# Altium schematic sheet Count_3x7Seg_Display.SchDoc
size 431 x 279 mm; SheetNumber: 1; SheetTotal: 1; ENG_APP_DATE: --/--/--; DSN_APP_DATE: --/--/--; CHK_APP_DATE: --/--/--
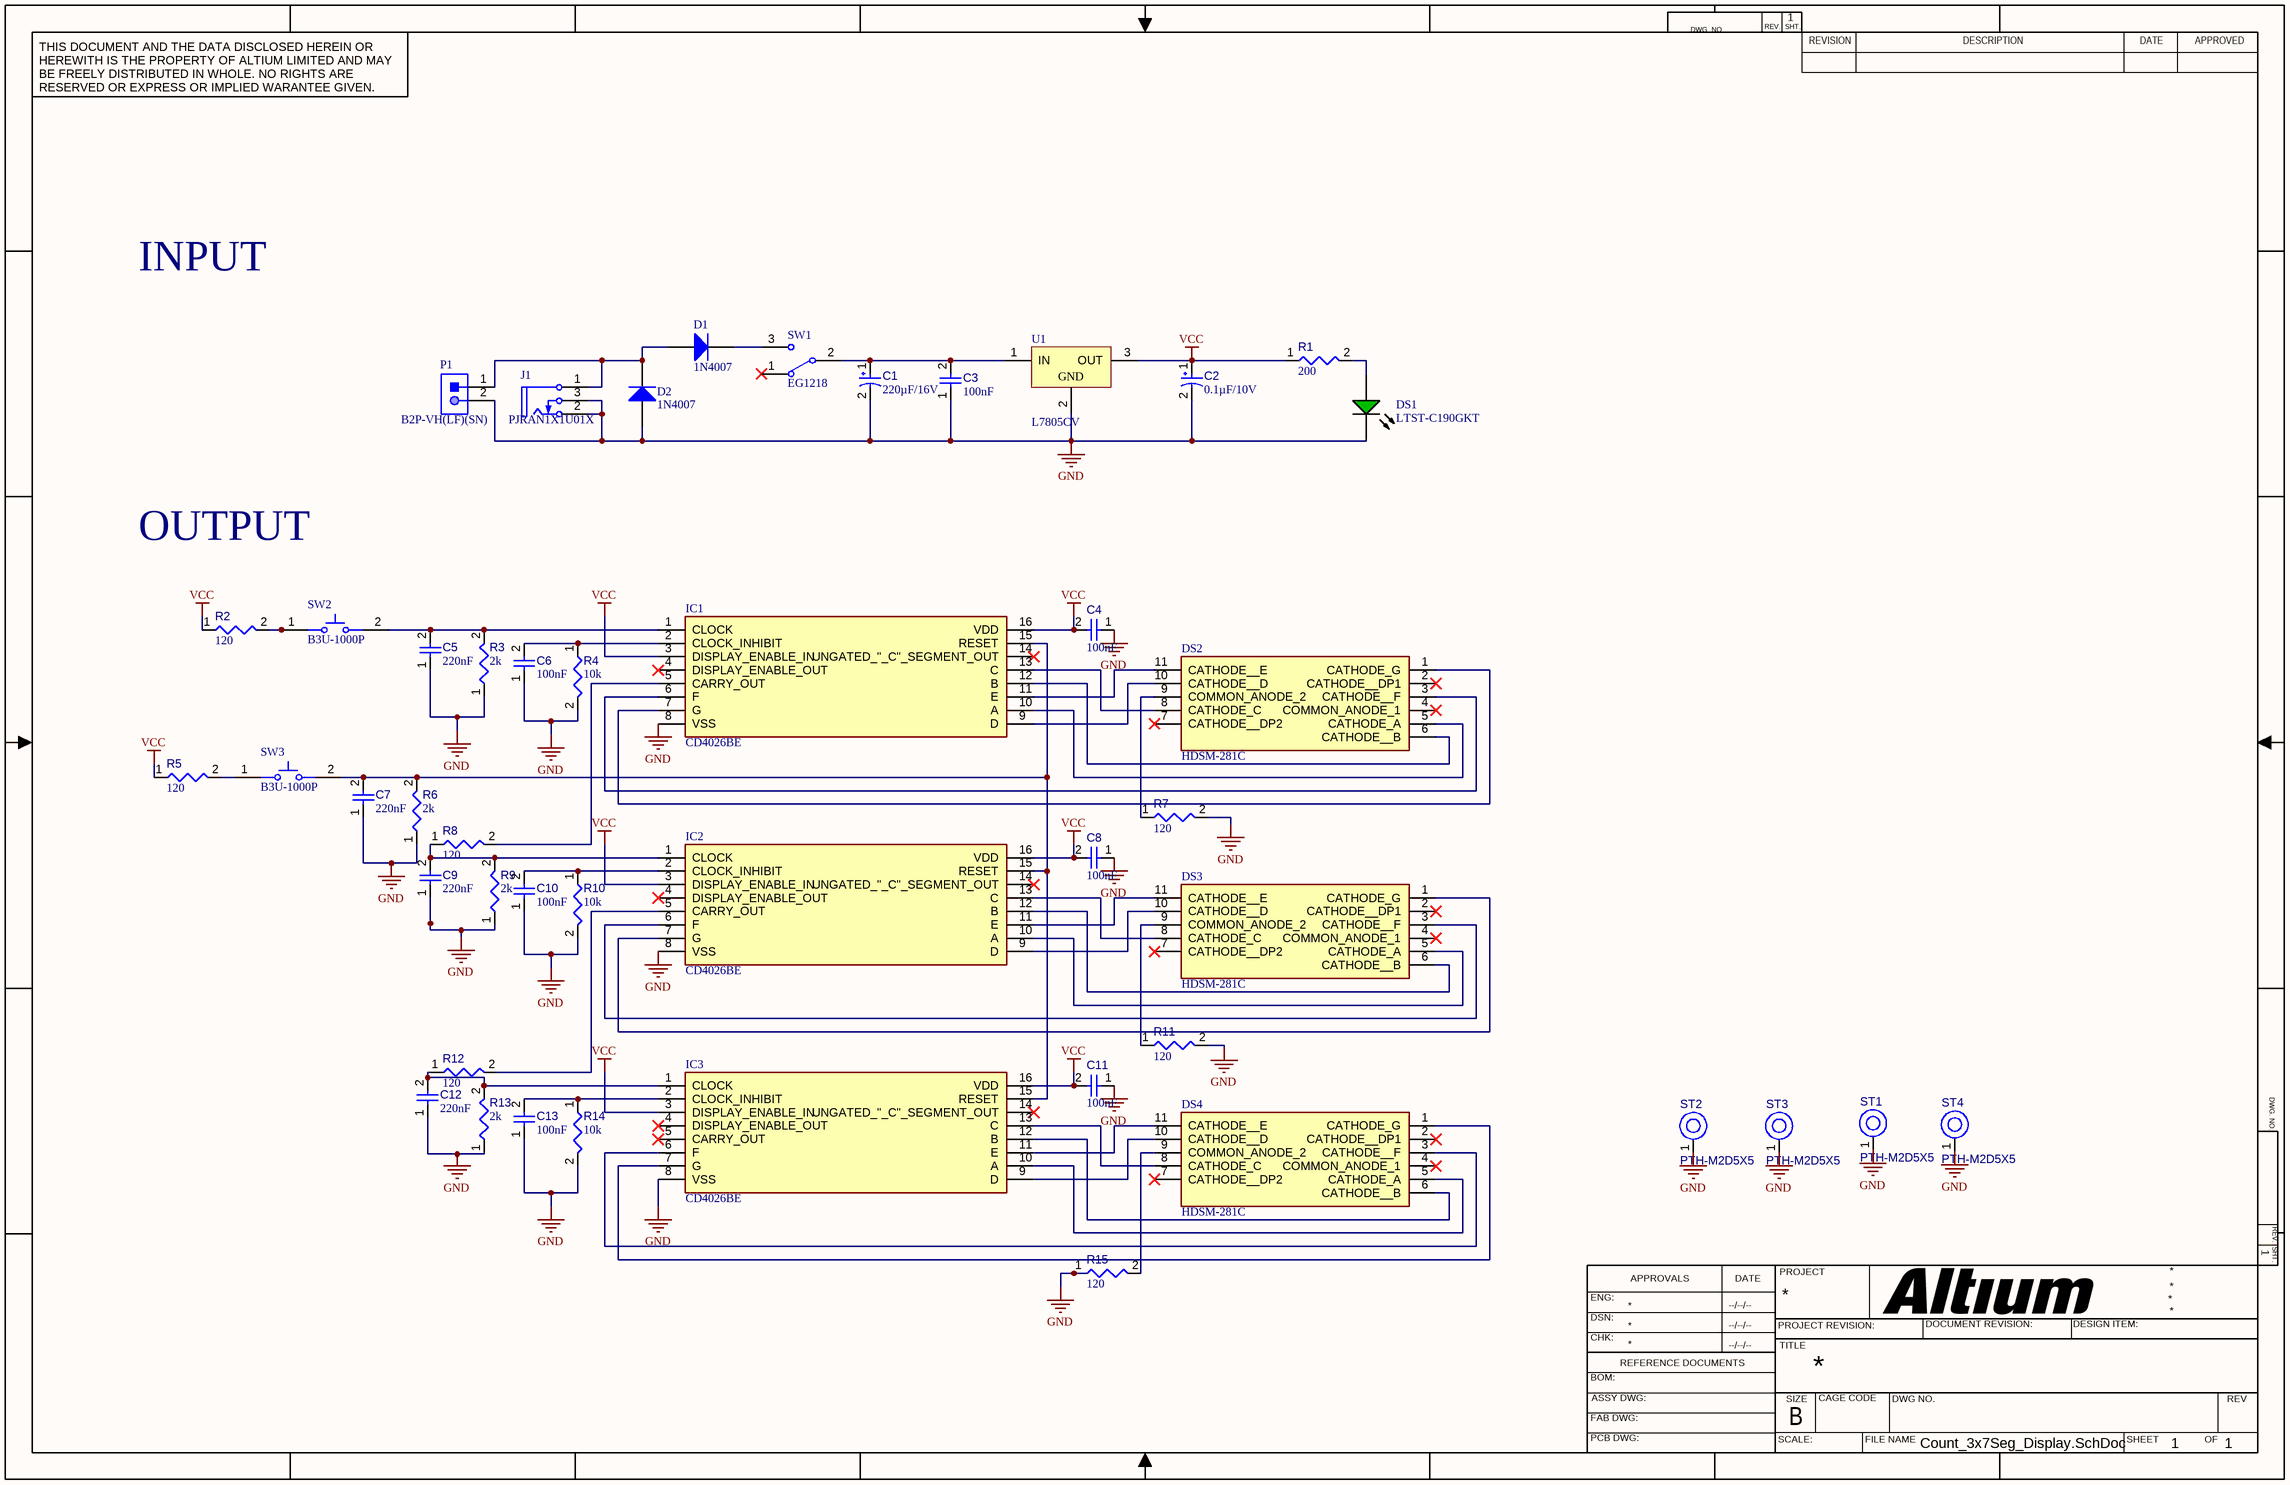
[diagram p0: Count_3x7Seg_Display.SchDoc]

## Parts
C1  value 220µF/16V  [CAPPR55-250-1120X630X1220]  (hidden comment: ECA-1HM470)
C2  value 0.1µF/10V  [CAPPR55-250-1120X630X1220]  (hidden comment: ECA-1HM470)
C3  value 100nF  [CAPC1608X90X40NL10T20]  (hidden comment: Capacitor 100 nF +/-10% 50 V 0603)
C4  value 100nF  [CAPC1608X90X40NL10T20]  (hidden comment: Capacitor 100 nF +/-10% 50 V 0603)
C5  value 220nF  [CAPC0402(1005)60_L]  (hidden comment: Capacitor 220nF +/-20% 10V 0402)
C6  value 100nF  [CAPC1608X90X40NL10T20]  (hidden comment: Capacitor 100 nF +/-10% 50 V 0603)
C7  value 220nF  [CAPC0402(1005)60_L]  (hidden comment: Capacitor 220nF +/-20% 10V 0402)
C8  value 100nF  [CAPC1608X90X40NL10T20]  (hidden comment: Capacitor 100 nF +/-10% 50 V 0603)
C9  value 220nF  [CAPC0402(1005)60_L]  (hidden comment: Capacitor 220nF +/-20% 10V 0402)
C10  value 100nF  [CAPC1608X90X40NL10T20]  (hidden comment: Capacitor 100 nF +/-10% 50 V 0603)
C11  value 100nF  [CAPC1608X90X40NL10T20]  (hidden comment: Capacitor 100 nF +/-10% 50 V 0603)
C12  value 220nF  [CAPC0402(1005)60_L]  (hidden comment: Capacitor 220nF +/-20% 10V 0402)
C13  value 100nF  [CAPC1608X90X40NL10T20]  (hidden comment: Capacitor 100 nF +/-10% 50 V 0603)
D1  1N4007  [FAIR-DO-41-2]
D2  1N4007  [FAIR-DO-41-2]
DS1  LTST-C190GKT  [LTST-C190GKT_V]
DS2  HDSM-281C  [HDSM283L]
DS3  HDSM-281C  [HDSM283L]
DS4  HDSM-281C  [HDSM283L]
IC1  CD4026BE  [DIP794W53P254L1930H508Q16N]
IC2  CD4026BE  [DIP794W53P254L1930H508Q16N]
IC3  CD4026BE  [DIP794W53P254L1930H508Q16N]
J1  PJRAN1X1U01X  [SWIT-PJRAN1X1U01X_V]
P1  B2P-VH(LF)(SN)  [JST-B2P-VH(LF)(SN)_V]
R1  value 200  [RESC0402(1005)_L]  (hidden comment: 200R2J)
R2  value 120  [RESC0603(1608)_L]  (hidden comment: 120R3J)
R3  value 2k  [RESC0402(1005)_L]  (hidden comment: Resistor 2K +/-5 % 0402 63 mW)
R4  value 10k  [RESC1005X40X25ML05T05]  (hidden comment: Resistor 10k +/-1% 0402 100 mW)
R5  value 120  [RESC0603(1608)_L]  (hidden comment: 120R3J)
R6  value 2k  [RESC0402(1005)_L]  (hidden comment: Resistor 2K +/-5 % 0402 63 mW)
R7  value 120  [RESC0603(1608)_L]  (hidden comment: 120R3J)
R8  value 120  [RESC0603(1608)_L]  (hidden comment: 120R3J)
R9  value 2k  [RESC0402(1005)_L]  (hidden comment: Resistor 2K +/-5 % 0402 63 mW)
R10  value 10k  [RESC1005X40X25ML05T05]  (hidden comment: Resistor 10k +/-1% 0402 100 mW)
R11  value 120  [RESC0603(1608)_L]  (hidden comment: 120R3J)
R12  value 120  [RESC0603(1608)_L]  (hidden comment: 120R3J)
R13  value 2k  [RESC0402(1005)_L]  (hidden comment: Resistor 2K +/-5 % 0402 63 mW)
R14  value 10k  [RESC1005X40X25ML05T05]  (hidden comment: Resistor 10k +/-1% 0402 100 mW)
R15  value 120  [RESC0603(1608)_L]  (hidden comment: 120R3J)
ST1  PTH-M2D5X5  [PTH-M2D5X5]
ST2  PTH-M2D5X5  [PTH-M2D5X5]
ST3  PTH-M2D5X5  [PTH-M2D5X5]
ST4  PTH-M2D5X5  [PTH-M2D5X5]
SW1  EG1218  [ESWI-EG1218_V]
SW2  B3U-1000P  [OMRON-B3U-1000_V]
SW3  B3U-1000P  [OMRON-B3U-1000_V]
U1  L7805CV  [TO220]

## Nets
GND: C1.2 C2.2 C3.1 C4.1 C5.1 C6.1 C7.1 C8.1 C9.1 C10.1 C11.1 C12.1 C13.1 D2.2(A) DS1.2(K) IC1.8(VSS) IC2.8(VSS) IC3.8(VSS) J1.2(TIP) J1.3(SHUNT) P1.2 R3.1 R4.2 R6.1 R7.2 R9.1 R10.2 R11.2 R13.1 R14.2 R15.1 ST1.1(H1) ST2.1(H1) ST3.1(H1) ST4.1(H1) U1.2(GND)
VCC: C2.1 C4.2 C8.2 C11.2 IC1.3(DISPLAY_ENABLE_IN) IC1.16(VDD) IC2.3(DISPLAY_ENABLE_IN) IC2.16(VDD) IC3.3(DISPLAY_ENABLE_IN) IC3.16(VDD) R1.1 R2.1 R5.1 U1.3(OUT)
NetC1_1: C1.1 C3.2 SW1.2(COM) U1.1(IN)
NetC5_2: C5.2 IC1.1(CLOCK) R3.2 SW2.2
NetC6_2: C6.2 IC1.2(CLOCK_INHIBIT) R4.1
NetC7_2: C7.2 IC1.15(RESET) IC2.15(RESET) IC3.15(RESET) R6.2 SW3.2
NetC9_2: C9.2 IC2.1(CLOCK) R8.1 R9.2
NetC10_2: C10.2 IC2.2(CLOCK_INHIBIT) R10.1
NetC12_2: C12.2 IC3.1(CLOCK) R12.1 R13.2
NetC13_2: C13.2 IC3.2(CLOCK_INHIBIT) R14.1
NetD1_1: D1.1(K) SW1.3
NetD1_2: D1.2(A) D2.1(K) J1.1(SLEEVE) P1.1
NetDS1_1: DS1.1(A) R1.2
NetDS2_1: DS2.1(CATHODE_G) IC1.7(G)
NetDS2_3: DS2.3(CATHODE__F) IC1.6(F)
NetDS2_5: DS2.5(CATHODE_A) IC1.10(A)
NetDS2_6: DS2.6(CATHODE__B) IC1.12(B)
NetDS2_8: DS2.8(CATHODE_C) IC1.13(C)
NetDS2_9: DS2.9(COMMON_ANODE_2) R7.1
NetDS2_10: DS2.10(CATHODE__D) IC1.9(D)
NetDS2_11: DS2.11(CATHODE__E) IC1.11(E)
NetDS3_1: DS3.1(CATHODE_G) IC2.7(G)
NetDS3_3: DS3.3(CATHODE__F) IC2.6(F)
NetDS3_5: DS3.5(CATHODE_A) IC2.10(A)
NetDS3_6: DS3.6(CATHODE__B) IC2.12(B)
NetDS3_8: DS3.8(CATHODE_C) IC2.13(C)
NetDS3_9: DS3.9(COMMON_ANODE_2) R11.1
NetDS3_10: DS3.10(CATHODE__D) IC2.9(D)
NetDS3_11: DS3.11(CATHODE__E) IC2.11(E)
NetDS4_1: DS4.1(CATHODE_G) IC3.7(G)
NetDS4_3: DS4.3(CATHODE__F) IC3.6(F)
NetDS4_5: DS4.5(CATHODE_A) IC3.10(A)
NetDS4_6: DS4.6(CATHODE__B) IC3.12(B)
NetDS4_8: DS4.8(CATHODE_C) IC3.13(C)
NetDS4_9: DS4.9(COMMON_ANODE_2) R15.2
NetDS4_10: DS4.10(CATHODE__D) IC3.9(D)
NetDS4_11: DS4.11(CATHODE__E) IC3.11(E)
NetIC1_5: IC1.5(CARRY_OUT) R8.2
NetIC2_5: IC2.5(CARRY_OUT) R12.2
NetR2_2: R2.2 SW2.1
NetR5_2: R5.2 SW3.1

Not connected (* = marked no-connect by the designer): DS2 2(CATHODE__DP1)* 4(COMMON_ANODE_1)* 7(CATHODE__DP2)*; DS3 2(CATHODE__DP1)* 4(COMMON_ANODE_1)* 7(CATHODE__DP2)*; DS4 2(CATHODE__DP1)* 4(COMMON_ANODE_1)* 7(CATHODE__DP2)*; IC1 4(DISPLAY_ENABLE_OUT)* 14(UNGATED_"_C"_SEGMENT_OUT)*; IC2 4(DISPLAY_ENABLE_OUT)* 14(UNGATED_"_C"_SEGMENT_OUT)*; IC3 4(DISPLAY_ENABLE_OUT)* 5(CARRY_OUT)* 14(UNGATED_"_C"_SEGMENT_OUT)*; SW1 1*

## Notes on the sheet
- INPUT
- OUTPUT
- DWG. NO.
- REV.
- SHT.
- THIS DOCUMENT AND THE DATA DISCLOSED HEREIN OR HEREWITH IS THE PROPERTY OF ALTIUM LIMITED AND MAY BE FREELY DISTRIBUTED IN WHOLE. NO RIGHTS ARE RESERVED OR EXPRESS OR IMPLIED WARANTEE GIVEN.
- REVISION
- DESCRIPTION
- DATE
- APPROVED
- ENG:
- APPROVALS
- PROJECT
- DSN:
- CHK:
- REFERENCE DOCUMENTS
- PROJECT REVISION:
- TITLE
- DOCUMENT REVISION:
- DESIGN ITEM:
- BOM:
- FAB DWG:
- PCB DWG:
- ASSY DWG:
- SCALE:
- SIZE
- B
- CAGE CODE
- FILE NAME
- DWG NO.
- SHEET
- OF
- REV

## Library data of the parts
C1 C2 = CMP-001-00031-7: Aluminum Electrolytic Capacitor, 47 uF, +/-20%, 50 V, -40 to 85 degC, 2-Pin THD, RoHS, Bulk; Manufacturer: Panasonic; Ripple Current: 130mA; Voltage Rating: 50V; Tolerance: 20%; RoHS Compliant: True; Lead Pitch: 2.5mm; Packaging: Bulk; Case/Package: Radial; Diameter: 6.3mm; Datasheet Version: Apr-16; Mounting Technology: TH; Max Operating Temperature: 85°C; Package Quantity: 200; Package Description: 2-Pin Radial Lead, Dia 6.3 mm, Height 12.2 mm; Capacitor Type: Electrolytic; Min Operating Temperature: -40°C; Ripple Current (AC): 130mA; Manufacturer URL: http://www.panasonic.com/; Pins: 2; Datasheet URL: https://industrial.panasonic.com/cdbs/www-data/pdf/RDF0000/DMF0000COL72.pdf; Package Reference: CAPPR55-250-1120X630X1220
C3 C4 C6 C8 C10 C11 C13 = CMP-001-00017-6: Chip Capacitor, 100 nF, +/- 10%, 50 V, 0603 (1608 Metric); Voltage Rating: 50V; Capacitor Type: Ceramic; Tolerance: 10%; Mounting Technology: SM; Max Operating Temperature: 125°C; RoHS Compliant: True; Pins: 2; Case/Package: 0603; Min Operating Temperature: -55°C
C5 C7 C9 C12 = CMP-001-00057-3: Chip Capacitor, 220nF +/-20%, 10V, 0402, Thickness 0.6 mm; Tolerance: 10%; Max Operating Temperature: 85°C; Pins: 2; Case/Package: 0402; Mounting Technology: SMT; Voltage Rating: 10V; Min Operating Temperature: -55°C
D1 D2 = CMP-004-00007-2: General Purpose Rectifier, 1.1 V, 1.0 A, -55 to 175 degC, 2-Pin DO-41, RoHS, Tape and Reel; Manufacturer: Fairchild; Peak Reverse Current: 5uA; Max Surge Current: 30A; Elements: 1; Forward Voltage: 1.1V; Package Version: Rev. 2, 09/2008; Forward Current: 1A; Package Quantity: 5000; Packaging: TapeandReel; Package URL: http://www.fairchildsemi.com/dwg/DO/DO41A.pdf; Manufacturer URL: https://www.fairchildsemi.com/; Package Reference: DO-41-2; Pins: 2; Min Operating Temperature: -55°C; Datasheet Version: Rev. 1.1.0, 11/2014; Max Operating Temperature: 175°C; RoHS Compliant: True; Case/Package: DO-41-2; Mounting Technology: TH; Package Description: 2-Pin Axial Lead, Dia 2.375 mm, Body Length 4.63 mm; Datasheet URL: https://www.fairchildsemi.com/datasheets/1N/1N4007.pdf
DS1 = CMP-007-00022-2: LED Uni-Color Green, 100 mW, 30 mA, -55 to 85 degC, 2-Pin SMD, RoHS, Tape and Reel; Manufacturer: Lite-On; Power: 100mW; Forward Voltage: 2.1V; Viewing Angle: 130degrees; Forward Current: 20mA; Luminous Intensity: 6mcd; Lens Style: Clear; Manufacturer URL: http://www.us.liteon.com/; RoHS Compliant: True; Colour: Green; Package Description: 2-Pin Surface Mount Device, Body 1.6 x 0.8 mm; Datasheet URL: http://datasheet.octopart.com/LTST-C190GKT-Lite-On-datasheet-158530.pdf; Datasheet Version: Dec-06; Mounting Technology: SM; Case/Package: 0603; Package Reference: C190GKT; Packaging: TapeandReel; Min Operating Temperature: -55°C; Nominal Vf: 2.1V; Package Quantity: 3000; Illumination Colour: Green; Max Operating Temperature: 85°C; Pins: 2
DS2-DS4 = HDSM-281C: Display; Manufacturer_Name: Avago Technologies; Datasheet Link: https://datasheet.datasheetarchive.com/originals/distributors/SFDatasheet-4/sf-00083599.pdf; Height: 3.15mm; Manufacturer_Part_Number: HDSM-281C; Mouser Part Number: 630-HDSM-281C; Mouser Price/Stock: https://www.mouser.co.uk/ProductDetail/Broadcom-Avago/HDSM-281C?qs=NCV3C3qdz%2FDIiI0K2Ja0mg%3D%3D
IC1-IC3 = CD4026BE: Integrated Circuit; Manufacturer_Name: Texas Instruments; Datasheet Link: http://www.ti.com/lit/ds/symlink/cd4026b.pdf; Height: 5.08mm; Manufacturer_Part_Number: CD4026BE; Mouser Part Number: 595-CD4026BE; Mouser Price/Stock: https://www.mouser.co.uk/ProductDetail/Texas-Instruments/CD4026BE?qs=bkMXpVdiF42nXhwyXNpecA%3D%3D; Arrow Part Number: CD4026BE; Arrow Price/Stock: https://www.arrow.com/en/products/cd4026be/texas-instruments?region=nac
J1 = CMP-002-00008-2: Female Phono Jack, 3 Position, Height 13 mm, Tail Length 4 mm, RoHS, Bulk; Manufacturer: Switchcraft; Voltage Rating: 34V; Shielding: Unshielded; Current Rating: 2A; Connector Type: Audio; Min Operating Temperature: -25°C; Contact Plating: Silver; Manufacturer URL: http://www.switchcraft.com/; Pins: 1; RoHS Compliant: True; Package Reference: PJRAN1X1U01X; Datasheet Version: Rev. A, 01/2006; Package Description: Female Phono Jack, 3 Position, Height 13 mm, Tail Length 4 mm; Gender: Female; Max Operating Temperature: 85°C; Case/Package: Metal; Datasheet URL: http://www.conxall.com/Drawings/pjran1x1u__x_series_cd.pdf; Contact Material: Copper; Colour: Black; Max Current Rating: 2A; Mounting Technology: TH; Max Voltage Rating (DC): 34V; Package Quantity: 1
P1 = CMP-002-00025-2: Male Header, Pitch 3.96 mm, 1 x 2 Position, Height 10.9 mm, Tail Length 3.7 mm, -25 to 85 degC, RoHS, Bulk; Manufacturer: JST; Case/Package: B2P-VH(LF)(SN); Connector Type: Header; Mounting Technology: TH; Package Reference: B2P-VH(LF)(SN); Package Description: Male Header, Pitch 3.96 mm, 1 x 2 Position, Height 10.9 mm, Tail Length 3.7 mm; Max Operating Temperature: 85°C; Manufacturer URL: http://www.jst.com/home2.html; RoHS Compliant: Unknown; Datasheet Version: May-16; Gender: Male; Min Operating Temperature: -25°C; Datasheet URL: http://www.jst-mfg.com/product/pdf/eng/eVH.pdf
R1 = CMP-009-00079-2: 200R 0.063W 5% 0402 (1005 Metric)  SMD; Power: 63mW; Case/Package: 0402; Tolerance: 5%; Mounting Technology: SMT; Pins: 2
R2 R5 R7 R8 R11 R12 R15 = CMP-009-00069-2: 120R 0.1W 5% 0603 (1608 Metric)  SMD; Power: 100mW; Mounting Technology: SMT; Tolerance: 5%; Case/Package: 0603; Pins: 2
R3 R6 R9 R13 = CMP-009-00138-3: Chip Resistor, 2 kOhms, +/-5 %, 63 mW, -55 to 155 degC, 0402; Tolerance: 5%; Power: 63mW; Max Operating Temperature: 155°C; Pins: 2; Min Operating Temperature: -55°C; Case/Package: 0402
R4 R10 R14 = CMP-009-00015-5: Chip Resistor, 10 KOhm, +/- 1%, 0.1 W, -55 to 155 degC, 0402 (1005 Metric); Voltage Rating: 50V; Power: 100mW; Case/Package: 0402; RoHS Compliant: True; Min Operating Temperature: -55°C; Mounting Technology: SM; Tolerance: 1%; Max Operating Temperature: 155°C; Pins: 2
ST1-ST4 = CMP-00028-00004-2: M2 PTH (2.5mm), 5mm pad; Pins: 1
SW1 = CMP-011-00006-2: Slide Switch, SPDT, 500 V, -20 to 70 degC, 3-Pin THD, RoHS, Bulk; Manufacturer: E-Switch; Voltage Rating (DC): 30V; Current Rating: 200mA; Operating Force: 250gf; Package Quantity: 1000; Contact Plating: Silver; Max Operating Temperature: 70°C; Min Operating Temperature: -20°C; Contact Material: Copper; Datasheet URL: https://www.e-switch.com/system/asset/product_line/data_sheet/119/EG.pdf; Contact Finish: Silver; Case/Package: EG1218; Voltage Rating (AC): 30V; Datasheet Version: Oct-15; Package Description: 3-Pin Through Hole Device, Body 11.6 x 4 mm, Pitch 2.5 mm; RoHS Compliant: True; Package Reference: EG1218; Manufacturer URL: http://www.e-switch.ch/en/; Throw Configuration: SPDT; Contact Current Rating: 200mA; Mounting Technology: TH; Packaging: Bulk; Pins: 3
SW2 SW3 = CMP-011-00000-2: Tactile Switch, SPST-NO, 0.05 A, 12 V, -25 to 70 degC, 2-Pin SMD, RoHS, Tape and Reel; Manufacturer: Omron Electronic Components; IP Rating: IP40; Current Rating: 50mA; Max Contact Resistance: 100mohm; Operating Force: 153gf; Throw Configuration: SPST; Resistance: 0.1Ohm; Max Voltage Rating (DC): 12V; Contact Material: Silver; Max Current Rating: 50mA; Datasheet URL: http://www.omron.com/ecb/products/pdf/en-b3u.pdf; Mounting Technology: SM; Case/Package: B3U-1000; Packaging: TapeandReel; Package Reference: B3U-1000; Manufacturer URL: http://www.omron.com/; Datasheet Version: Jan-15; RoHS Compliant: True; Max Operating Temperature: 70°C; Contact Current Rating: 50mA; Package Quantity: 3500; Package Description: 2-Pin Surface Mount Device, Body 3 x 2.5 mm; Voltage Rating (DC): 12V; Min Operating Temperature: -25°C; Voltage Rating: 12V
U1 = CMP-019-00018-3: Positive Voltage Regulator IC, 1.5 A, 5 V, 0 to 125 degC, 3-Pin TO-220, RoHS, Tube; Manufacturer: STMicroelectronics; Max Input Voltage: 35V; Min Supply Voltage: 8V; Nominal Output Voltage: 5V; Outputs: 1; Output Current: 1.5A; Dropout Voltage: 2V; Max Supply Voltage: 20V; Min Input Voltage: 7V; Datasheet Version: Rev 30, 09/2012; Min Operating Temperature: 0°C; Manufacturer URL: http://www.st.com/; Pins: 3; Mounting Technology: TH; Output Voltage: 5V; RoHS Compliant: True; Max Ouput Current: 1.5A; Datasheet URL: https://datasheet.ciiva.com/15111/getdatasheetpartid-44136-15111027.pdf; Packaging: Rail/Tube; Max Operating Temperature: 125°C; Case/Package: TO-220; Package Quantity: 50